# Altium schematic sheet Accessories.SchDoc: LEDs & Push Buttons & USB-C Connector
size A4; Date: Not used; ApprovedBy: Not used; CheckedBy: Not used; Author: Not used; CompanyName: STMicroelectronics; DrawnBy: Not used; Engineer: Not used; Organization: Not used; Address1: Not used; Address2: Not used; Address3: Not used; Address4: Not used; DocumentNumber: Not used; Revision: Not used; SheetNumber: 4; SheetTotal: 7; CurrentTime: Not used; CurrentDate: Not used; Time: Not used; DocumentFullPathAndName: Not used; DocumentName: Not used; ModifiedDate: Not used; ImagePath: Not used; ProjectName: Not used; Application_BuildNumber: Not used
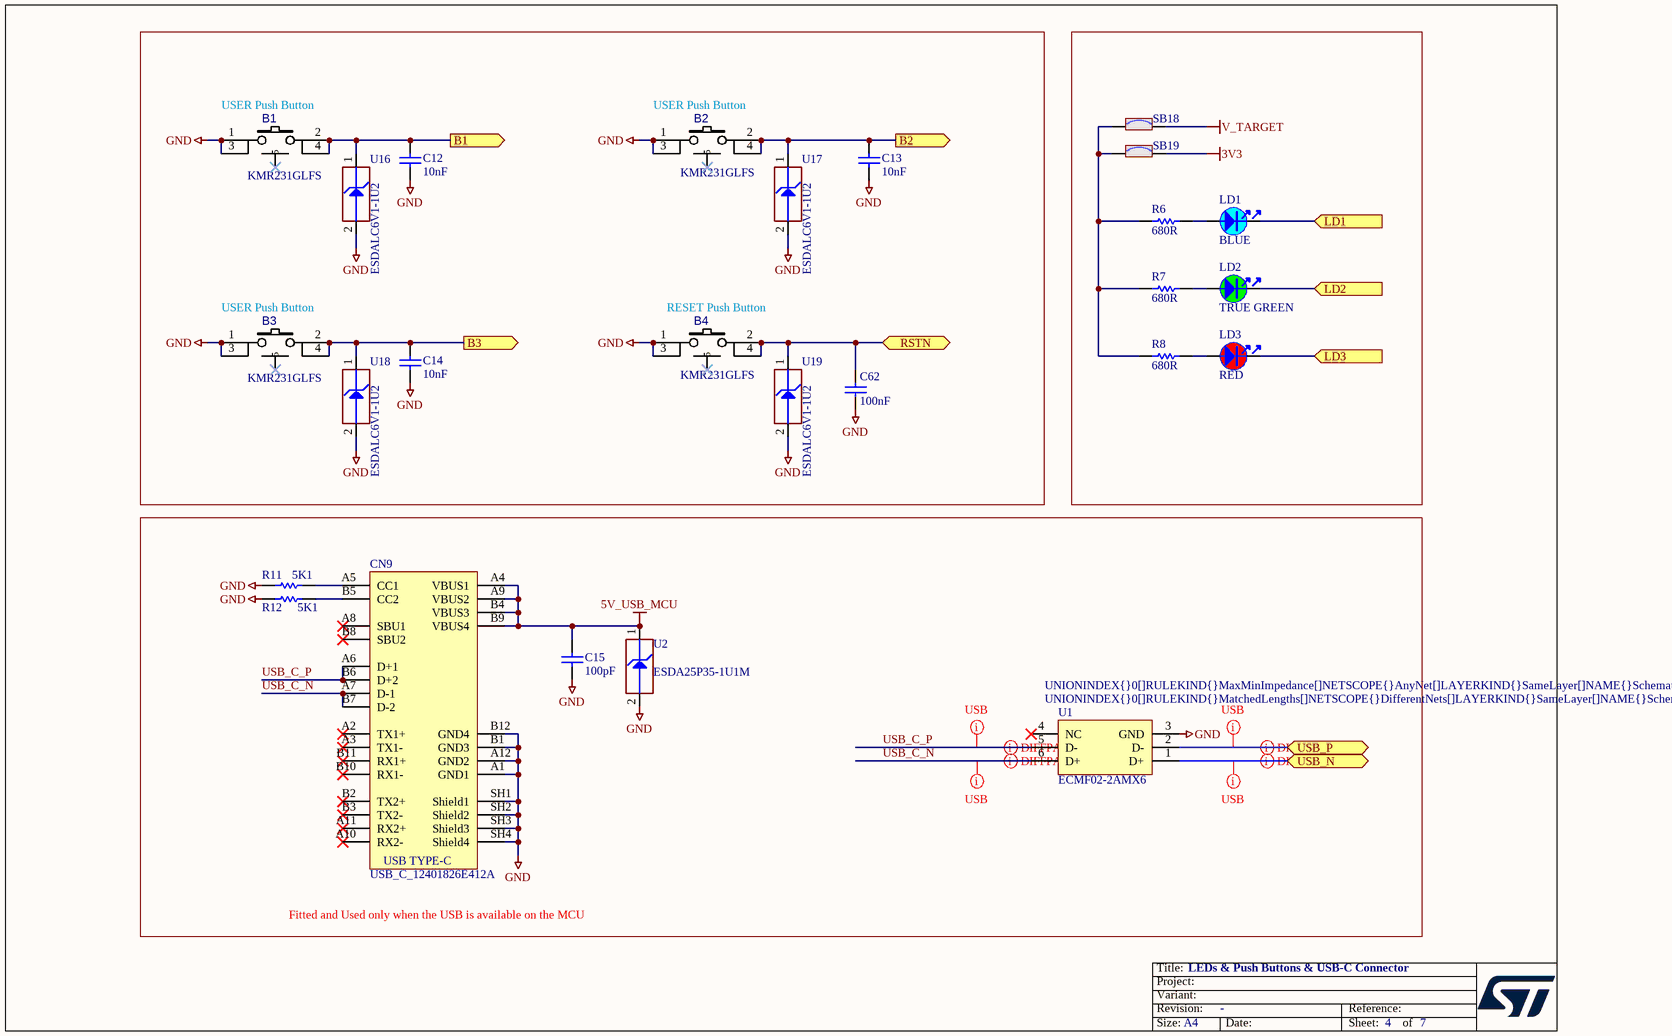
[diagram p0: Accessories.SchDoc]

## Parts
B1  value KMR231GLFS  [SWI_C&K_Y78B23110FP__ITT_KMR231GLFS]  (hidden comment: SW-PUSH-CMS_KMR2_BLACK)
B2  value KMR231GLFS  [SWI_C&K_Y78B23110FP__ITT_KMR231GLFS]  (hidden comment: SW-PUSH-CMS_KMR2_BLACK)
B3  value KMR231GLFS  [SWI_C&K_Y78B23110FP__ITT_KMR231GLFS]  (hidden comment: SW-PUSH-CMS_KMR2_BLACK)
B4  value KMR231GLFS  [SWI_C&K_Y78B23110FP__ITT_KMR231GLFS]  (hidden comment: SW-PUSH-CMS_KMR2_BLACK)
C12  value 10nF  [C0402]  (hidden comment: Capacitor)
C13  value 10nF  [C0402]  (hidden comment: Capacitor)
C14  value 10nF  [C0402]  (hidden comment: Capacitor)
C15  value 100pF  [C0402]  (hidden comment: Capacitor)
C62  value 100nF  [C0402]  (hidden comment: Capacitor)
CN9  value USB_C_12401826E412A  [CON_USB-TYPEC_AMPHENOL_12401826E412A]  (hidden comment: USB_TYPE_C_Receptacle)
LD1  value BLUE  [LED_0603_VISHAY_VLMB1300-GS08_BLUE_1A2K_H0P8]  (hidden comment: LED_blue)
LD2  value TRUE GREEN  [LED_0603_VISHAY_VLMTG1300-GS08_GREEN_1A2K_H0P8]  (hidden comment: LED_green)
LD3  value RED  [LED_0603_VISHAY_VLMS1300-GS08_RED_1A2K_H0P8]  (hidden comment: LED_red)
R6  value 680R  [R0402]  (hidden comment: Resistor)
R7  value 680R  [R0402]  (hidden comment: Resistor)
R8  value 680R  [R0402]  (hidden comment: Resistor)
R11  value 5K1  [R0402]  (hidden comment: Resistor)
R12  value 5K1  [R0402]  (hidden comment: Resistor)
SB18  SB_ON  [SOLDER-BRIDGE_R0402-0R]  (value not drawn)
SB19  SB_ON  [SOLDER-BRIDGE_R0402-0R]  (value not drawn)
U1  ECMF02-2AMX6  [ESD_QFN-6L_1P7X1P5_P050]
U2  value ESDA25P35-1U1M  [ESD_QFN1610_2N_1K_2A]  (hidden comment: ESD-TRANSIL)
U16  value ESDALC6V1-1U2  [ESD_ST0201]  (hidden comment: ESD-TRANSIL)
U17  value ESDALC6V1-1U2  [ESD_ST0201]  (hidden comment: ESD-TRANSIL)
U18  value ESDALC6V1-1U2  [ESD_ST0201]  (hidden comment: ESD-TRANSIL)
U19  value ESDALC6V1-1U2  [ESD_ST0201]  (hidden comment: ESD-TRANSIL)

## Blocks framed on the sheet
Fitted and Used only when the USB is available on the MCU: C15 CN9 R11 R12 U1 U2

## Ports
B1 (out), B2 (out), B3 (out), LD1 (in), LD2 (in), LD3 (in), RSTN (bidir), USB_N (bidir), USB_P (bidir)

## Nets
3V3: SB19.2
5V_USB_MCU: C15.2 CN9.A4(VBUS1) CN9.A9(VBUS2) CN9.B4(VBUS3) CN9.B9(VBUS4) U2.1(IO1)
GND: B1.1 B1.3 B2.1 B2.3 B3.1 B3.3 B4.1 B4.3 C12.1 C13.1 C14.1 C15.1 C62.2 CN9.A1(GND1) CN9.A12(GND2) CN9.B1(GND3) CN9.B12(GND4) CN9.SH1(Shield1) CN9.SH2(Shield2) CN9.SH3(Shield3) CN9.SH4(Shield4) R11.1 R12.1 U1.3(GND) U2.2(GND) U16.2(GND) U17.2(GND) U18.2(GND) U19.2(GND)
V_TARGET: SB18.2
B1: B1.2 B1.4 C12.2 U16.1(IO1) ; port B1
B2: B2.2 B2.4 C13.2 U17.1(IO1) ; port B2
B3: B3.2 B3.4 C14.2 U18.1(IO1) ; port B3
LD1: LD1.2 ; port LD1
LD2: LD2.2 ; port LD2
LD3: LD3.2 ; port LD3
RSTN: B4.2 B4.4 C62.1 U19.1(IO1) ; port RSTN
USB_C_N: CN9.A7(D-1) CN9.B7(D-2) U1.6(D+)
USB_C_P: CN9.A6(D+1) CN9.B6(D+2) U1.5(D-)
USB_N: U1.1(D+) ; port USB_N
USB_P: U1.2(D-) ; port USB_P
NetCN9_A5: CN9.A5(CC1) R11.2
NetCN9_B5: CN9.B5(CC2) R12.2
NetLD1_1: LD1.1 R6.2
NetLD2_1: LD2.1 R7.2
NetLD3_1: LD3.1 R8.2
NetR6_1: R6.1 R7.1 R8.1 SB18.1 SB19.1

Not connected (* = marked no-connect by the designer): B1 5*; B2 5*; B3 5*; B4 5*; CN9 A2(TX1+)* A3(TX1-)* A8(SBU1)* A10(RX2-)* A11(RX2+)* B2(TX2+)* B3(TX2-)* B8(SBU2)* B10(RX1-)* B11(RX1+)*; U1 4(NC)*

## Layout directives
differential pair; rule Impedance Constraint [Min = 85.00    Max = 95.00    ]: USB_C_N, USB_C_P, USB_N, USB_P
rule Undefined; rule Matched Net Lengths [Tolerance = 2mm]; rule Impedance Constraint [Min = 85.00    Max = 95.00    ]: USB_C_N, USB_C_P, USB_N, USB_P

## Notes on the sheet
- (near B1) USER Push Button
- (near B2) USER Push Button
- (near B3) USER Push Button
- (near B4) RESET Push Button
- Title:
- Project:
- Size:
- Revision:
- Variant:
- A4
- -
- Date:
- Reference:
- Sheet:
- of
- (in symbol MCD-03232) USB TYPE-C

## Library data of the parts
B1-B4 = MCD-01485: Microminiature Tact Switch for SMT - KMR 2 Series - 1.9 mm height; Part_Type: Misc; Manufacturer: C&K; Part_Preference: Recommended; Component_Country_Of_Origin: France; Internal_Part_Number: MCD-01485; Status: Released; Manufacturer_Part_Number: KMR231GLFS; ComponentLink1URL: http://tunmcdsvn.tun.st.com/Component_Datasheet_Library/Trunk/Misc/C&K_tactile_switch_KMR_series
C12-C14 = MCD-02198: Capacitor, MLCC, 10nF, 50V, X7R, +/-10%, 0402, T=0.5mm; Part_Preference: Recommended; Manufacturer: YAGEO; Manufacturer_Part_Number: CC0402KRX7R9BB103; Order_Code_RS: 6169644; Component_Country_Of_Origin: China; Internal_Part_Number: MCD-02198; Status: Checked; Part_Type: Capacitor; Package: 0402; ComponentLink1URL: http://tunmcdsvn.tun.st.com/Component_Documentation_Library/Trunk/Capacitor/YAGEO_X7R_Series; Order_Code_Digikey: N/A; Order_Code_Farnell: N/A
C15 = MCD-00205: Capacitor, MLCC, 100pF, 50V, NPO, +/-5%, 0402, T=0.5mm; Manufacturer_Part_Number: CC0402JRNPO9BN101; Manufacturer: YAGEO; Part_Preference: Recommended; Component_Country_Of_Origin: China; Internal_Part_Number: MCD-00205; Status: Released; Part_Type: Capacitor; Package: 0402; ComponentLink1URL: http://tunmcdsvn.tun.st.com/Component_Documentation_Library/Trunk/Capacitor/YAGEO_NP0_Series; Order_Code_Digikey: 311-1024-1-ND; Order_Code_Farnell: 3019226RL; Order_Code_RS: N/A
C62 = MCD-00006: Capacitor, MLCC, 100nF, 16V, X7R, 10%, 0402, T=0.5mm; Manufacturer_Part_Number: CC0402KRX7R7BB104; Manufacturer: YAGEO; Alternate_Manufacturer_Part_Number: GCM155R71C104KA55D; Alternate_Manufacturer: MURATA; Provided_By: SUBCO; Internal_Part_Number: MCD-00006; ComponentLink1Description: Datasheet; Status: Released; Package: C0402; Part_Type: Capacitor; ComponentLink1URL: http://tunmcdsvn.tun.st.com/Component_Datasheet_Library/Trunk/Capacitors/Yageo_Multilayer_Capacitor_X7R_series_100pF_to_22uF
CN9 = MCD-03232: USB_TypeC, 24 pins, RA, SMD, T=2.96mm; Part_Type: Connector; Part_Preference: Recommended; Manufacturer: AMPHENOL ICC; Manufacturer_Part_Number: 12401826E412A; Component_Country_Of_Origin: China°; ShowFields: YES; ID: 5348; Internal_Part_Number: MCD-03232; Status: Released; ComponentLink1URL: http://tunmcdsvn.tun.st.com/Component_Documentation_Library/Trunk/Connector/AMPHEMOL_ICC_12401826E412A; Order_Code_Digikey: 12401826E412ATR-ND; Order_Code_Farnell: 3727763; Order_Code_RS: N/A
LD1 = MCD-00584: LED Blue, 0603 SMD, 3.3 V Forward Voltage; Part_Type: Display; Manufacturer_Part_Number: VLMB1300-GS08; Manufacturer: VISHAY; Part_Preference: Recommended; Order_Code_RS: 7730430; Component_Country_Of_Origin: China; Internal_Part_Number: MCD-00584; Status: Released; Package: LED 0603; ComponentLink1URL: http://tunmcdsvn.tun.st.com/Component_Datasheet_Library/Trunk/Display/VISHAY_LED_BLUE_VLMB1300-GS08; Order_Code_Digikey: VLMB1300-GS08CT-ND; Order_Code_Farnell: 2251459
LD2 = MCD-00589: LED Green, 0603 SMD, Fw Voltage = 2.8V - 3.6V; Part_Type: Display; Manufacturer_Part_Number: VLMTG1300-GS08; Manufacturer: VISHAY; Part_Preference: Recommended; Order_Code_RS: 7730452; Component_Country_Of_Origin: China; Internal_Part_Number: MCD-00589; Status: Released; Package: LED 0603; ComponentLink1URL: http://tunmcdsvn.tun.st.com/Component_Datasheet_Library/Trunk/Display/VISHAY_LED_GREEN_VLMTG1300-GS08; Order_Code_Digikey: VLMTG1300-GS08CT-ND; Order_Code_Farnell: 2251490
LD3 = MCD-00587: LED Red, 0603 SMD, 2V Forward Voltage; Part_Type: Display; Manufacturer_Part_Number: VLMS1300-GS08; Manufacturer: VISHAY; Part_Preference: Recommended; Alternate_Internal_Part_Number: MCD-02401; Component_Country_Of_Origin: China; Internal_Part_Number: MCD-00587; Status: Released; Package: LED 0603; ComponentLink1URL: http://tunmcdsvn.tun.st.com/Component_Datasheet_Library/Trunk/Display/VISHAY_LED_RED_VLMS1300-GS08; Order_Code_Digikey: VLMS1300-GS08CT-ND; Order_Code_Farnell: 2078728
R6-R8 = MCD-00507: Resistor, 680R, 0402, +/-1%, 1/16W; Manufacturer_Part_Number: RC0402FR-07680RL; Manufacturer: YAGEO; Part_Preference: Recommended; Component_Country_Of_Origin: China; Internal_Part_Number: MCD-00507; Status: Released; Part_Type: Resistor; Package: 0402; ComponentLink1URL: http://tunmcdsvn.tun.st.com/Component_Documentation_Library/Trunk/Resistor/YAGEO_RC_L_Series; Order_Code_Digikey: 311-680LRCT-ND; Order_Code_Farnell: 9239219; Order_Code_RS: N/A
R11 R12 = MCD-00333: Resistor, 5K1, 0402, +/-1%, 1/16W; Manufacturer_Part_Number: RC0402FR-075K1L; Manufacturer: YAGEO; Part_Preference: Recommended; Component_Country_Of_Origin: China; Internal_Part_Number: MCD-00333; Status: Released; Part_Type: Resistor; Package: 0402; ComponentLink1URL: http://tunmcdsvn.tun.st.com/Component_Documentation_Library/Trunk/Resistor/YAGEO_RC_L_Series; Order_Code_Digikey: 311-5.10KLRCT-ND; Order_Code_Farnell: 1458805; Order_Code_RS: N/A
SB18 SB19 = MCD-01618: Solder Bridge 0402 ON; Part_Type: Misc; Part_Preference: Recommended; Manufacturer: YAGEO; Manufacturer_Part_Number: RC0402JR-070RL; Order_Code_RS: 618-5804; Component_Country_Of_Origin: China; Internal_Part_Number: MCD-01618; Status: Released; Package: SB0402; ComponentLink1URL: http://tunmcdsvn.tun.st.com/Component_Datasheet_Library/Trunk/Resistors/Yageo_Resistor_RC0402-series; Order_Code_Digikey: 311-0.0JRTR-ND; Order_Code_Farnell: 2363467
U1 = MCD-00649: Common mode filter with ESD protection for USB 2.0 interface; Part_Type: Diode; Manufacturer: STMICROELECTRONICS; BMS_Part_Number: 9151138; Part_Preference: Recommended; Manufacturer_HQ_COO: EU; Component_Country_Of_Origin: China; Internal_Part_Number: MCD-00649; Value: ECMF02-2AMX6; Status: Released; Manufacturer_Part_Number: ECMF02-2AMX6; ComponentLink1URL: http://tunmcdsvn.tun.st.com/Component_Datasheet_Library/Trunk/Diodes/STM_ESD_ECMF02-2AMX6
U2 = MCD-01207: High power Transient voltage suppressor:25V/35A EOS and ESD transients protection.; Part_Type: Diode; Manufacturer: STMICROELECTRONICS; BMS_Part_Number: 9179045; Part_Preference: Recommended; Manufacturer_HQ_COO: EU; Component_Country_Of_Origin: China; Internal_Part_Number: MCD-01207; Status: Released; Manufacturer_Part_Number: ESDA25P35-1U1M; ComponentLink1URL: http://tunmcdsvn.tun.st.com/Component_Datasheet_Library/Trunk/Diodes/STM_ESD_ESDA25P35-1U1M; Package: QFN1610
U16-U19 = MCD-00170: ESD protection 6V1; BMS_Part_Number: 9151132; Part_Type: Diode; Part_Preference: Recommended; Manufacturer: STMICROELECTRONICS; Manufacturer_HQ_COO: EU; Component_Country_Of_Origin: China; ShowFields: YES; ID: 2696; Internal_Part_Number: MCD-00170; Status: Released; Manufacturer_Part_Number: ESDALC6V1-1U2; ComponentLink1URL: http://tunmcdsvn.tun.st.com/Component_Documentation_Library/Trunk/Diode/STMICROELECTRONICS_ESDALC6V1-1U2; Order_Code_Digikey: N/A; Order_Code_Farnell: N/A; Order_Code_RS: N/A